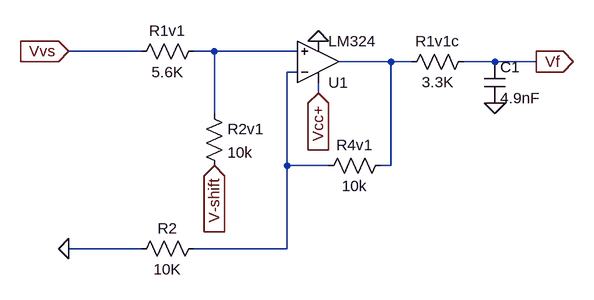
[diagram p0: schematic sig_cond.asc]
sig_cond.asc, the LTspice schematic file:
Version 4.1
SHEET 1 880 680
WIRE -1072 -3600 -1184 -3600
WIRE -960 -3600 -992 -3600
WIRE -832 -3600 -960 -3600
WIRE -688 -3584 -768 -3584
WIRE -656 -3584 -688 -3584
WIRE -528 -3584 -576 -3584
WIRE -464 -3584 -528 -3584
WIRE -832 -3568 -848 -3568
WIRE -800 -3536 -800 -3552
WIRE -960 -3504 -960 -3600
WIRE -848 -3424 -848 -3568
WIRE -784 -3424 -848 -3424
WIRE -688 -3424 -688 -3584
WIRE -688 -3424 -704 -3424
WIRE -1072 -3296 -1184 -3296
WIRE -848 -3296 -848 -3424
WIRE -848 -3296 -992 -3296
FLAG -528 -3520 0
FLAG -464 -3584 Vf
IOPIN -464 -3584 Out
FLAG -1184 -3600 Vvs
IOPIN -1184 -3600 In
FLAG -960 -3424 V-shift
IOPIN -960 -3424 In
FLAG -800 -3536 Vcc+
IOPIN -800 -3536 In
FLAG -800 -3616 0
FLAG -1184 -3296 0
SYMBOL res -560 -3600 R90
WINDOW 0 0 56 VBottom 2
WINDOW 3 32 56 VTop 2
SYMATTR InstName R1v1c
SYMATTR Value 3.3K
SYMBOL cap -544 -3584 R0
SYMATTR InstName C1
SYMATTR Value 4.9nF
SYMBOL OpAmps\\opamp2 -800 -3520 M180
SYMATTR InstName U1
SYMATTR Value LM324
SYMBOL res -976 -3616 R90
WINDOW 0 0 56 VBottom 2
WINDOW 3 32 56 VTop 2
SYMATTR InstName R1v1
SYMATTR Value 5.6K
SYMBOL res -688 -3440 R90
WINDOW 0 0 56 VBottom 2
WINDOW 3 32 56 VTop 2
SYMATTR InstName R4v1
SYMATTR Value 10k
SYMBOL res -976 -3312 R90
WINDOW 0 0 56 VBottom 2
WINDOW 3 32 56 VTop 2
SYMATTR InstName R2
SYMATTR Value 10K
SYMBOL res -976 -3520 R0
SYMATTR InstName R2v1
SYMATTR Value 10k

The netlist it stands for:
* sig_cond.asc
R1v1c Vf N002 3.3K
C1 Vf 0 4.9nF
X§U1 N001 N003 Vcc+ 0 N002 LM324  ; pins In+ In- V+ V- OUT
R1v1 N001 Vvs 5.6K
R4v1 N002 N003 10k
R2 N003 0 10K
R2v1 N001 V-shift 10k
.backanno
.end